# EAGLE design Dog Fountain (EAGLE 6.4)
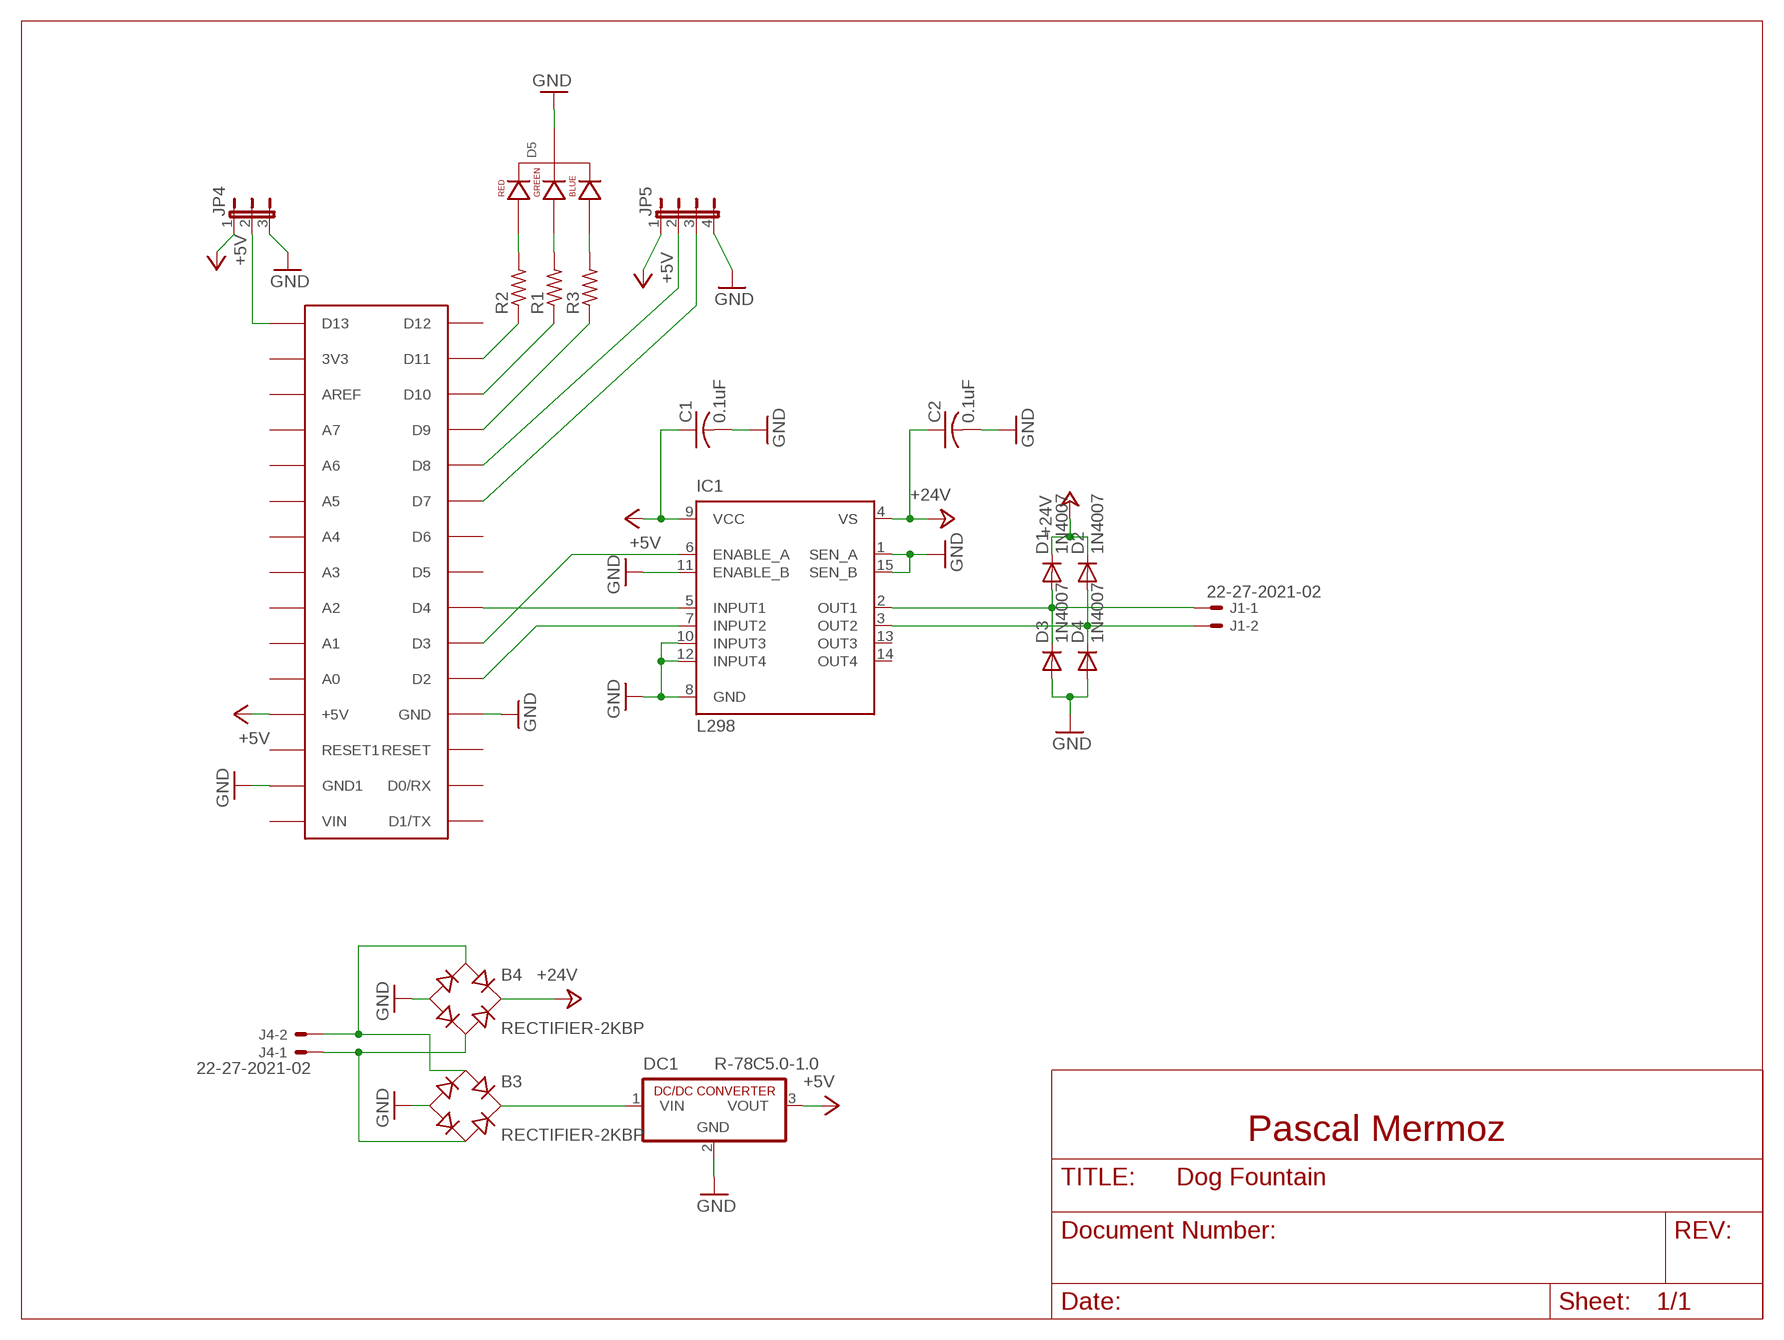
[diagram p0: schematic, sheet 1]

## Parts
B3  RECTIFIER-2KBP  [2KBP]
B4  RECTIFIER-2KBP  [2KBP]
C1  0.1uF  C-US050-024X044  [C050-024X044]
C2  0.1uF  C-US050-024X044  [C050-024X044]
D1  1N4007  DIODE-DO41-10  [DO41-10]
D2  1N4007  DIODE-DO41-10  [DO41-10]
D3  1N4007  DIODE-DO41-10  [DO41-10]
D4  1N4007  DIODE-DO41-10  [DO41-10]
D5  LED-RGB-CC-THRUDIFFUSE  [LED-RGB-THRU]
DC1  R-78C5.0-1.0  [SIP3]
IC1  L298  [MULTIWATT-15]
J1  22-27-2021-02  [6410-02]
J4  22-27-2021-02  [6410-02]
JP4  JP2E  [JP2]
JP5  JP4E  [JP4]
R1  R-US_0204/2V  [0204V]
R2  R-US_0204/2V  [0204V]
R3  R-US_0204/2V  [0204V]
U$1  ARDUINONANO  [PDIP-32]

## Nets
+5V: C1.1 DC1.3(VOUT) IC1.9(VCC) JP4.1 JP5.1 U$1.+5V
+24V: B4.+ C2.1 D1.C D2.C IC1.4(VS)
GND: B3.- B4.- C1.2 C2.2 D3.A D4.A D5.2(CATHODE) DC1.2(GND) IC1.1(SEN_A) IC1.8(GND) IC1.10(INPUT3) IC1.11(ENABLE_B) IC1.12(INPUT4) IC1.15(SEN_B) JP4.3 JP5.4 U$1.GND U$1.GND1
N$3: B3.+ DC1.1(VIN)
N$4: IC1.6(ENABLE_A) U$1.D3
N$5: IC1.5(INPUT1) U$1.D4
N$6: D2.A D4.C IC1.3(OUT2) J1.2
N$7: D1.A D3.C IC1.2(OUT1) J1.1
N$8: IC1.7(INPUT2) U$1.D2
N$9: B3.AC1 B4.AC1 J4.2
N$10: B3.AC2 B4.AC2 J4.1
N$11: JP4.2 U$1.D13
N$12: JP5.2 U$1.D8
N$13: JP5.3 U$1.D7
N$14: R3.1 U$1.D9
N$15: R1.1 U$1.D10
N$16: R2.1 U$1.D11
N$17: D5.1(RED_CATHODE) R2.2
N$18: D5.3(GREEN_CATHODE) R1.2
N$19: D5.4(BLUE_CATHODE) R3.2
Unconnected: IC1.13(OUT3) IC1.14(OUT4) U$1.3V3 U$1.A0 U$1.A1 U$1.A2 U$1.A3 U$1.A4 U$1.A5 U$1.A6 U$1.A7 U$1.AREF U$1.D0/RX U$1.D1/TX U$1.D5 U$1.D6 U$1.D12 U$1.RESET U$1.RESET1 U$1.VIN

## Notes on the sheet
- Pascal Mermoz

## Library data of the parts
B3 B4 = rectifier:RECTIFIER-: Rectifier; MPN: KBP202G; OC_NEWARK: 90R8778
C1 C2 = rcl:C-US: CAPACITOR, American symbol; MPN: C317C104K5R5TA; OC_NEWARK: 60M1325
D1-D4 = diode:DIODE-: DIODE; MPN: KBP202G; OC_NEWARK: 90R8778
D5 = SparkFun-LED:LED-RGB-CC-THRU: RGB Through-hole common cathode LED SparkFun Storefront: COM-00105 (Clear) COM-09264 (Diffuse); PROD_ID: DIO-09434
DC1 = dc-dc-converter:R-78C*-1.0: INNOLINE DC/DC-Converter 1.0 AMP SIP3 Single Output Source: Data sheet <http://www.mikrocontroller.net/attachment/150645/157764-da-01-en-DC_DC_WANDLER_R_78C5_0_1_0.pdf>; MPN: OKI-78SR-5/1.5-W36-C; OC_NEWARK: 72R3616
IC1 = st-microelectronics:L298: DUAL FULL-BRIDGE DRIVER; MPN: L298N; OC_FARNELL: 1589425; OC_NEWARK: 32M1527
J1 J4 = con-molex:22-?-02: CONNECTOR wire to board 2.54 mm (.1 inch) pitch header; OC_FARNELL: unknown; OC_NEWARK: unknown
JP4 = jumper:JP2E: JUMPER
JP5 = jumper:JP4E: JUMPER
R1-R3 = rcl:R-US_: RESISTOR, American symbol
U$1 = jet-lib:ARDUINONANO; MPN: A000005; OC_NEWARK: 13T9275

## Net classes
0 default: width 0.305 mm, drill 0.508 mm, clearance 0.254 mm

## Board
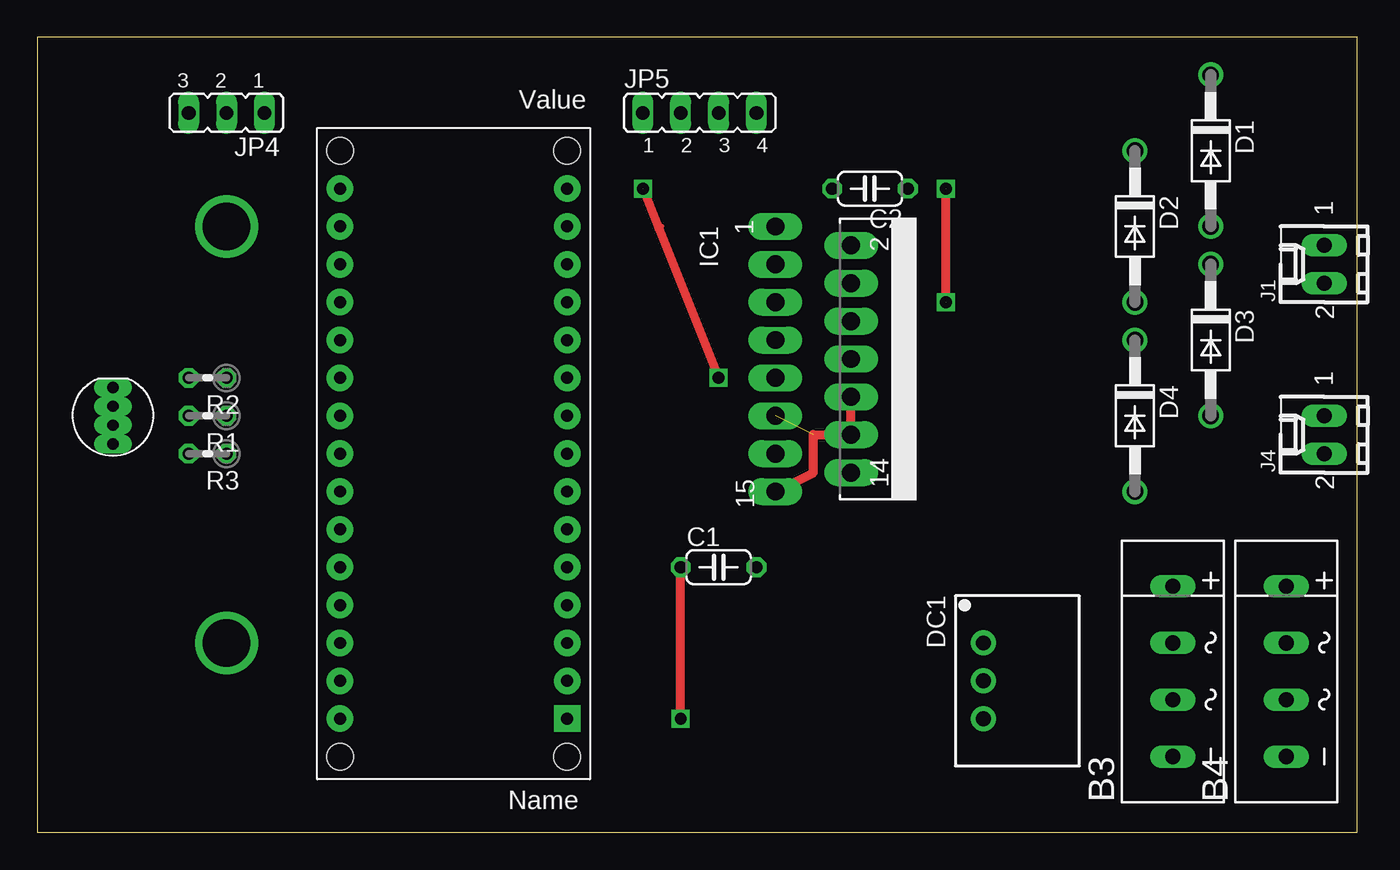
[diagram p1: board, top side]
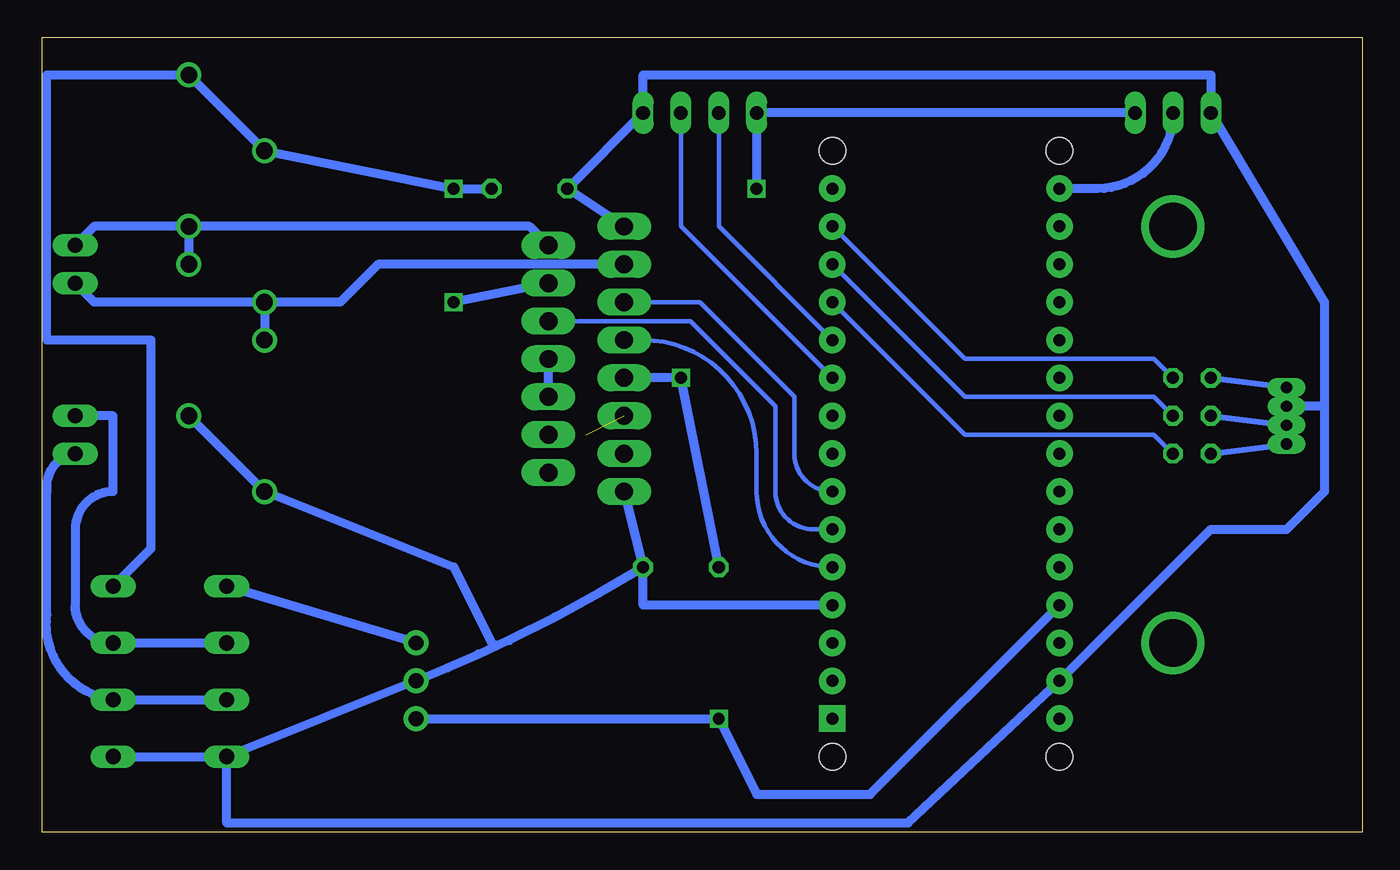
[diagram p2: board, bottom side, seen from below]

Size 88.57 x 53.33 mm. Coordinates in mm from the lower left corner, seen from the top.
Outline: 0,0 88.57,0 88.57,53.33 0,53.33 0,0
Copper layers (1*16): Top 0.035mm / dielectric 1.5mm / Bottom 0.035mm
Design rules "default": minimum track width 10mil, minimum drill 24mil, track to track 8mil, track to pad 8mil, pad to pad 8mil, via to via 8mil, smd to smd 8mil, copper to edge 40mil, drill to drill 8mil, minimum pad ring 10mil, minimum via ring 8mil, stop-mask expansion 4mil, vias tented up to drill 0mil, thermal gap 10mil
tRestrict: area 0,45.7 to 7.6,53.3; area 0,0 to 7.6,7.6

### Footprints (pad centres in the part's own frame; a part is rotated, then mirrored left to right if it is on the bottom)
2KBP = drill 1.016 long: + 5.715,0; - -5.715,0; AC1 -1.905,0; AC2 1.905,0
C050-024X044 = drill 0.813 octagon: 1 -2.54,0; 2 2.54,0
DO41-10 = drill 1.118: A 5.08,0; C -5.08,0
LED-RGB-THRU = drill 0.762 pad 0.889 long: 1 1.905,0; 2 0.635,0; 3 -0.635,0; 4 -1.905,0
SIP3 = drill 1 pad 1.676: 1 -2.54,0; 2 0,0; 3 2.54,0
MULTIWATT-15 = drill 1.2 long: 1 -8.89,-7.62; 2 -7.62,-2.54; 3 -6.35,-7.62; 4 -5.08,-2.54; 5 -3.81,-7.62; 6 -2.54,-2.54; 7 -1.27,-7.62; 8 0,-2.54; 9 1.27,-7.62; 10 2.54,-2.54; 11 3.81,-7.62; 12 5.08,-2.54; 13 6.35,-7.62; 14 7.62,-2.54; 15 8.89,-7.62
6410-02 = drill 1.016 long: 1 1.27,0; 2 -1.27,0
JP2 = drill 0.914 long: 1 -2.54,0; 2 0,0; 3 2.54,0
JP4 = drill 0.914 long: 1 -3.81,0; 2 -1.27,0; 3 1.27,0; 4 3.81,0
0204V = drill 0.813 octagon: 1 -1.27,0; 2 1.27,0
PDIP-32 = drill 0.8 pad 1.778: 3V3 15.24,-35.56; +5V 15.24,-10.16; A0 15.24,-12.7; A1 15.24,-15.24; A2 15.24,-17.78; A3 15.24,-20.32; A4 15.24,-22.86; A5 15.24,-25.4; A6 15.24,-27.94; A7 15.24,-30.48; AREF 15.24,-33.02; D0/RX 0,-5.08; D2 0,-12.7; D3 0,-15.24; D4 0,-17.78; D5 0,-20.32; D6 0,-22.86; D7 0,-25.4; D8 0,-27.94; D9 0,-30.48; D10 0,-33.02; D11 0,-35.56; D12 0,-38.1; D13 15.24,-38.1; GND 0,-10.16; GND1 15.24,-5.08; RESET 0,-7.62; RESET1 15.24,-7.62; VIN 15.24,-2.54 | drill 0.8 pad 1.778 square: D1/TX 0,-2.54 | hole 1.778: 0,0; 0,-40.64; 15.24,-40.64; 15.24,0

### Placement (x,y rotation side)
B3  76.2,10.79 90 top
B4  83.82,10.79 90 top
C1  45.72,17.78 0 top
C2  55.88,43.18 180 top
D1  78.74,45.72 270 top
D2  73.66,40.64 270 top
D3  78.74,33.02 270 top
D4  73.66,27.94 270 top
D5  5.08,27.94 90 top
DC1  63.5,10.16 270 top
IC1  57.15,31.75 270 top
J1  86.36,38.1 90 top
J4  86.36,26.67 90 top
JP4  12.7,48.26 180 top
JP5  44.45,48.26 0 top
R1  11.43,27.94 180 top
R2  11.43,30.48 180 top
R3  11.43,25.4 180 top
U$1  35.56,5.08 180 top

### Tracks (layer width: path | path; a pad name or v marks a point on that pad's centre or on a via)
+5V  (via drill 0.8)  (1 unrouted)
  Top 0.305: 41.91,40.64 41.69,40.55
  Top 0.61: 40.64,43.18 41.69,40.55 v45.72,30.48 | v43.18,7.62 C1.1
  Bottom 0.61: C1.1 v45.72,30.48 IC1.9 | JP4.1 JP5.1 40.64,43.18 | DC1.3 v43.18,7.62 40.64,2.54 33.02,2.54 U$1.+5V
+24V  (2 unrouted)
  Top 0.61: 60.96,35.56 60.96,43.18
  Bottom 0.61: B4.+ 81.28,19.05 81.28,33.02 88.27,33.02 88.27,50.8 D1.C D2.C 60.96,43.18 C2.1 | IC1.4 60.96,35.56
GND  (1 unrouted)
  Top 0.61: IC1.15 52.07,24.13 52.07,26.67 IC1.12 IC1.10
  Bottom 0.305: 58.42,12.7 57.15,12.7 57.25,12.9
  Bottom 0.61: B4.- B3.- | B3.- DC1.2 arc-4 57.25,12.9 arc-6 C1.2 | D3.A D4.A 60.96,17.78 58.42,12.7 | IC1.10 IC1.8 | B3.- 76.2,0.64 30.48,0.64 U$1.GND1 10.16,20.32 5.08,20.32 2.54,22.86 2.54,28.57 | 2.54,28.57 D5.2 | 2.54,28.57 2.54,35.56 JP4.3 10.16,50.8 48.26,50.8 JP5.4 C2.2 IC1.1 | U$1.GND 48.26,15.24 C1.2 | IC1.15 C1.2
N$1  (via drill 3.2)
  other vias: 12.7,40.64
N$2  (via drill 3.2)
  other vias: 12.7,12.7
N$3
  Bottom 0.61: DC1.1 B3.+
N$4
  Bottom 0.305: IC1.6 45.09,34.29 39.37,28.57 39.37,22.86 arc-90 36.83,20.32 U$1.D3
N$5
  Bottom 0.305: IC1.5 44.45,35.56 38.1,29.21 38.1,25.4 arc-90 U$1.D4
N$6
  Bottom 0.61: D2.A 85.09,35.56 J1.2 | IC1.3 66.04,38.1 68.58,35.56 D2.A | D2.A D4.C
N$7
  Bottom 0.61: D1.A 85.09,40.64 J1.1 | D1.A 55.88,40.64 IC1.2 | D1.A D3.C
N$8
  Bottom 0.305: IC1.7 48.26,33.02 arc90 40.64,25.4 40.64,22.86 arc-90 U$1.D2
N$9
  Bottom 0.61: B3.AC1 B4.AC1 arc90 88.27,14.61 88.27,22.86 arc90 J4.2
N$10
  Bottom 0.61: B3.AC2 B4.AC2 arc90 86.36,15.24 86.36,20.32 arc90 83.82,22.86 83.82,27.94 J4.1
N$11
  Bottom 0.61: JP4.2 arc90 17.78,43.18 U$1.D13
N$12
  Bottom 0.305: JP5.2 43.18,40.64 U$1.D8
N$13
  Bottom 0.305: JP5.3 45.72,40.64 U$1.D7
N$14
  Bottom 0.305: R3.1 13.97,26.67 26.67,26.67 U$1.D9
N$15
  Bottom 0.305: R1.1 13.97,29.21 26.67,29.21 U$1.D10
N$16
  Bottom 0.305: U$1.D11 26.67,31.75 13.97,31.75 R2.1
N$17
  Bottom 0.406: R2.2 D5.1
N$18
  Bottom 0.406: R1.2 D5.3
N$19
  Bottom 0.406: R3.2 D5.4
N$24  (via drill 0.8)
  other vias: 40.64,43.18
N$26  (via drill 0.8)
  other vias: 60.96,35.56
N$27  (via drill 0.8)
  other vias: 60.96,43.18